# EAGLE schematic MiniScreenStrip (EAGLE 6.5.0)
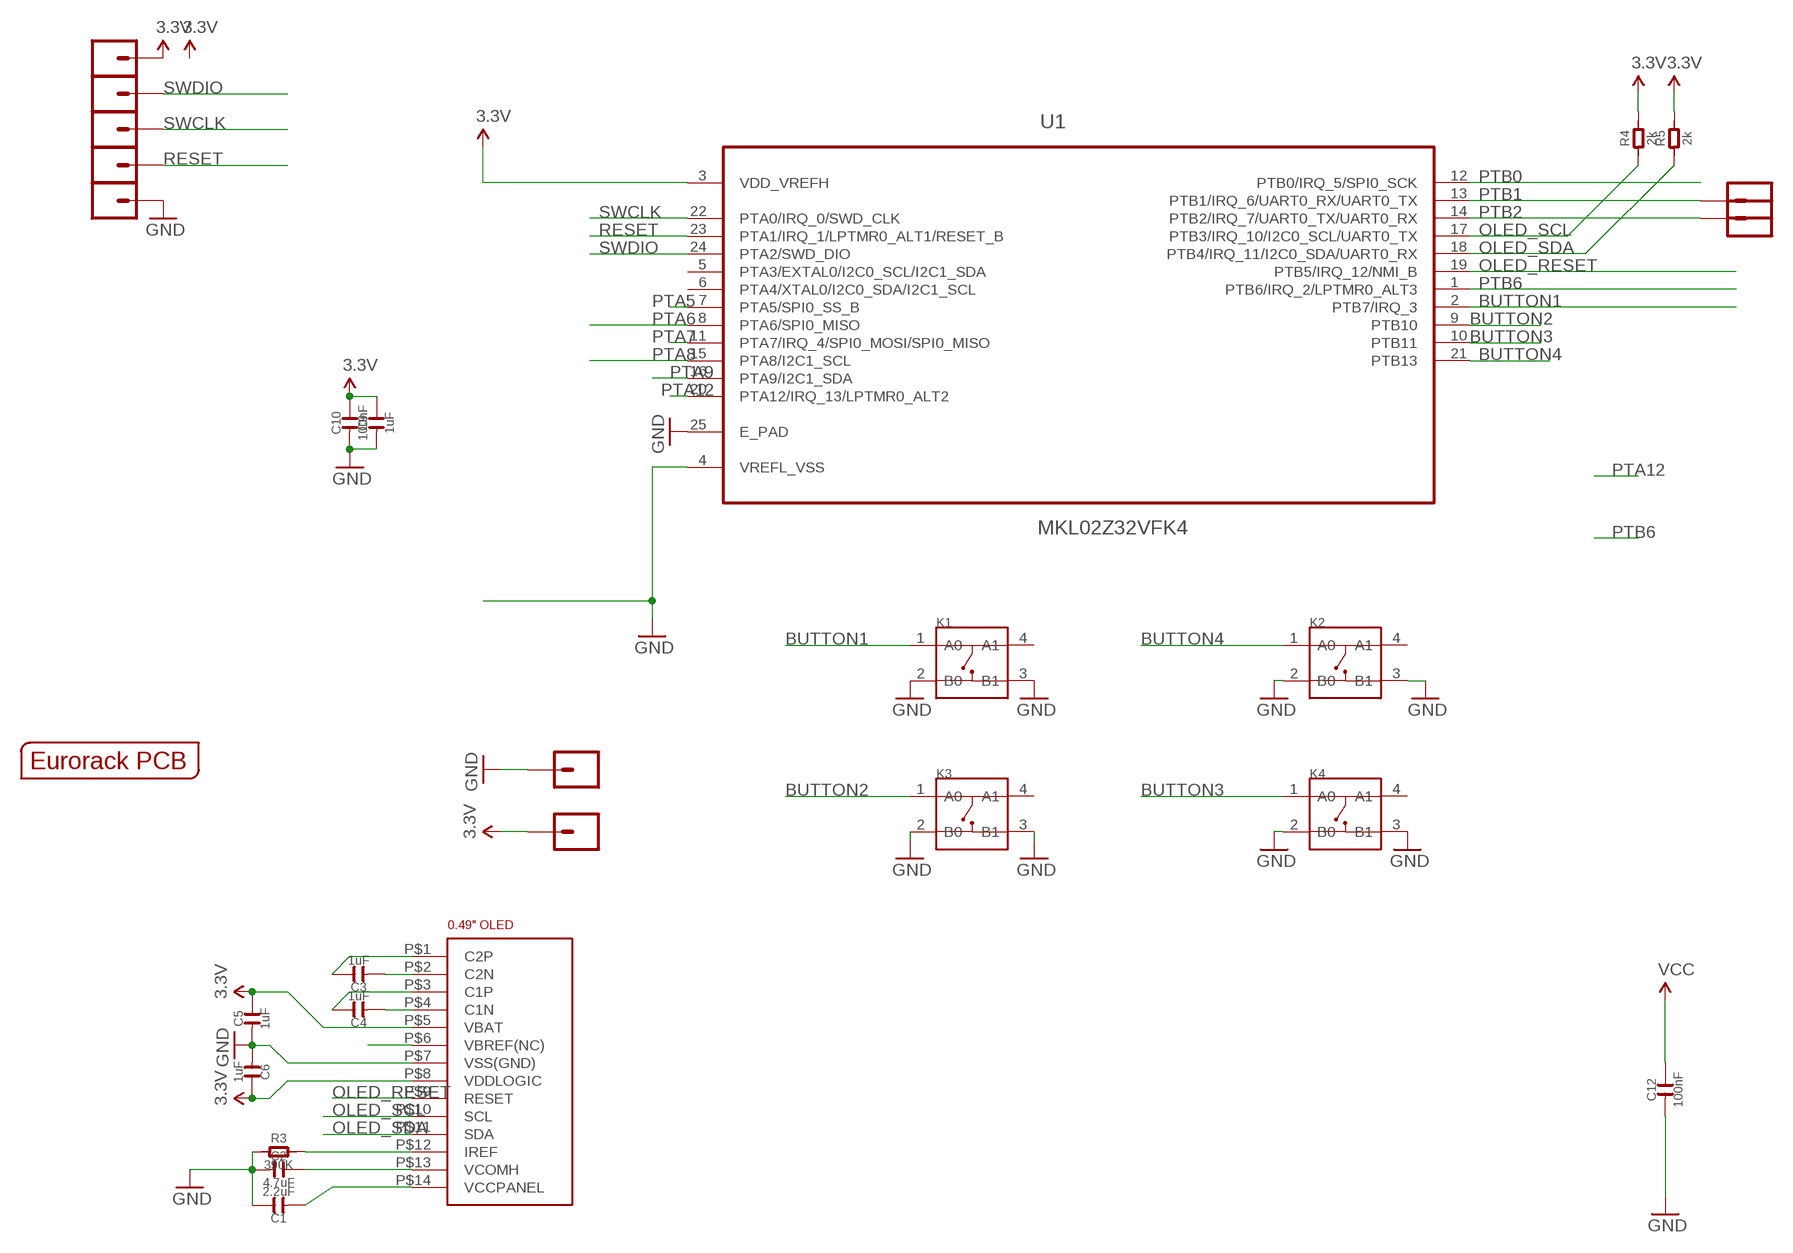
[diagram p0: schematic, sheet 1]

## Parts
C1  2.2uF  C-0603  [C0603]
C2  4.7uF  C-0603  [C0603]
C3  1uF  C-0603  [C0603]
C4  1uF  C-0603  [C0603]
C5  1uF  C-0603  [C0603]
C6  1uF  C-0603  [C0603]
C9  1uF  C-0603  [C0603]
C10  100nF  C-0603  [C0603]
C12  100nF  C-0603  [C0603]
K1  BUTTON-4P-3100010P1  [4P-SMD-6.0X6.0X5.0H]
K2  BUTTON-4P-3100010P1  [4P-SMD-6.0X6.0X5.0H]
K3  BUTTON-4P-3100010P1  [4P-SMD-6.0X6.0X5.0H]
K4  BUTTON-4P-3100010P1  [4P-SMD-6.0X6.0X5.0H]
PTA6_MISO1  M01SMD-4.5X1.5  [PAD-1.5X4.5]
PTA6_MISO2  M01SMD-4.5X1.5  [PAD-1.5X4.5]
PTA6_MISO3  M01SMD-4.5X1.5  [PAD-1.5X4.5]
PTA6_MISO4  M01SMD-4.5X1.5  [PAD-1.5X4.5]
PTA6_MISO5  M01SMD-4.5X1.5  [PAD-1.5X4.5]
PTB1_RXTX  M01SMD-4.5X1.5  [PAD-1.5X4.5]
PTB2_TXRX  M01SMD-4.5X1.5  [PAD-1.5X4.5]
PTB2_TXRX1  M01SMD-4.5X1.5  [PAD-1.5X4.5]
PTB2_TXRX2  M01SMD-4.5X1.5  [PAD-1.5X4.5]
R3  390K  R-0603  [R0603]
R4  2k  R-0603  [R0603]
R5  2k  R-0603  [R0603]
U1  MKL02Z32VFK4  [QFN50P400X400X100-25N]
U$1  0.49"OLEDFOLDED  [0.49"-FPC-0.7-14-FOLDED]
U$2  EURORACK_PCB4HP  [EURORACK4HPPCB]

## Nets
3.3V: C5.2 C6.2 C9.2 C10.2 C12.2 PTA6_MISO1.P$1 PTB2_TXRX1.P$1 R4.2 R5.2 U1.3(VDD_VREFH) U$1.P$5(VBAT) U$1.P$8(VDDLOGIC) ; supply symbol labelled VCC
BUTTON1: K1.1(A0) U1.2(PTB7/IRQ_3)
BUTTON2: K3.1(A0) U1.9(PTB10)
BUTTON3: K4.1(A0) U1.10(PTB11)
BUTTON4: K2.1(A0) U1.21(PTB13)
GND: C1.2 C2.1 C5.1 C6.1 C9.1 C10.1 C12.1 K1.2(B0) K1.3(B1) K2.2(B0) K2.3(B1) K3.2(B0) K3.3(B1) K4.2(B0) K4.3(B1) PTA6_MISO5.P$1 PTB2_TXRX2.P$1 R3.1 U1.4(VREFL_VSS) U1.25(E_PAD) U$1.P$7(VSS(GND))
N$3: C3.2 U$1.P$1(C2P)
N$4: C4.2 U$1.P$3(C1P)
N$8: U$1.P$6(VBREF(NC))
N$9: R3.2 U$1.P$12(IREF)
N$10: C1.1 U$1.P$14(VCCPANEL)
N$11: C2.2 U$1.P$13(VCOMH)
N$12: C3.1 U$1.P$2(C2N)
N$13: C4.1 U$1.P$4(C1N)
OLED_RESET: U1.19(PTB5/IRQ_12/NMI_B) U$1.P$9(RESET)
OLED_SCL: R4.1 U1.17(PTB3/IRQ_10/I2C0_SCL/UART0_TX) U$1.P$10(SCL)
OLED_SDA: R5.1 U1.18(PTB4/IRQ_11/I2C0_SDA/UART0_RX) U$1.P$11(SDA)
PTA5: U1.7(PTA5/SPI0_SS_B)
PTA6: U1.8(PTA6/SPI0_MISO)
PTA7: U1.11(PTA7/IRQ_4/SPI0_MOSI/SPI0_MISO)
PTA8: U1.15(PTA8/I2C1_SCL)
PTA9: U1.16(PTA9/I2C1_SDA)
PTA12: U1.20(PTA12/IRQ_13/LPTMR0_ALT2)
PTB0: U1.12(PTB0/IRQ_5/SPI0_SCK)
PTB1: PTB1_RXTX.P$1 U1.13(PTB1/IRQ_6/UART0_RX/UART0_TX)
PTB2: PTB2_TXRX.P$1 U1.14(PTB2/IRQ_7/UART0_TX/UART0_RX)
PTB6: U1.1(PTB6/IRQ_2/LPTMR0_ALT3)
RESET: PTA6_MISO4.P$1 U1.23(PTA1/IRQ_1/LPTMR0_ALT1/RESET_B)
SWCLK: PTA6_MISO3.P$1 U1.22(PTA0/IRQ_0/SWD_CLK)
SWDIO: PTA6_MISO2.P$1 U1.24(PTA2/SWD_DIO)
Unconnected: K1.4(A1) K2.4(A1) K3.4(A1) K4.4(A1) U1.5(PTA3/EXTAL0/I2C0_SCL/I2C1_SDA) U1.6(PTA4/XTAL0/I2C0_SDA/I2C1_SCL)

## Library data of the parts
C1-C6 C9 C10 C12 = OPL:C*
K1-K4 = zephod-components:BUTTON-4P
PTA6_MISO1-PTA6_MISO5 PTB1_RXTX PTB2_TXRX PTB2_TXRX1 PTB2_TXRX2 = SparkFun-Connectors:M01: Header 1 Standard 1-pin 0.1" header. Use with straight break away headers (SKU : PRT-00116), right angle break away headers (PRT-00553), swiss pins (PRT-00743), machine pins (PRT-00117), and female headers (PRT-00115).
R3-R5 = OPL:R*
U1 = FarnellThings:MKL02Z32VFK4: IC, MCU, 32BIT, CORTEX M0+, 48MHZ, QFN-24; MPN: MKL02Z32VFK4; OC_FARNELL: 2321481; OC_NEWARK: 61W9887; PACKAGE: QFN-24; SUPPLIER: FREESCALE SEMICONDUCTOR
U$1 = zephod-tft:0.49"OLED
U$2 = EurorackModularParts:EURORACK_PCB